# Altium project PW-TPS6213x-TestDemo.PrjPCB
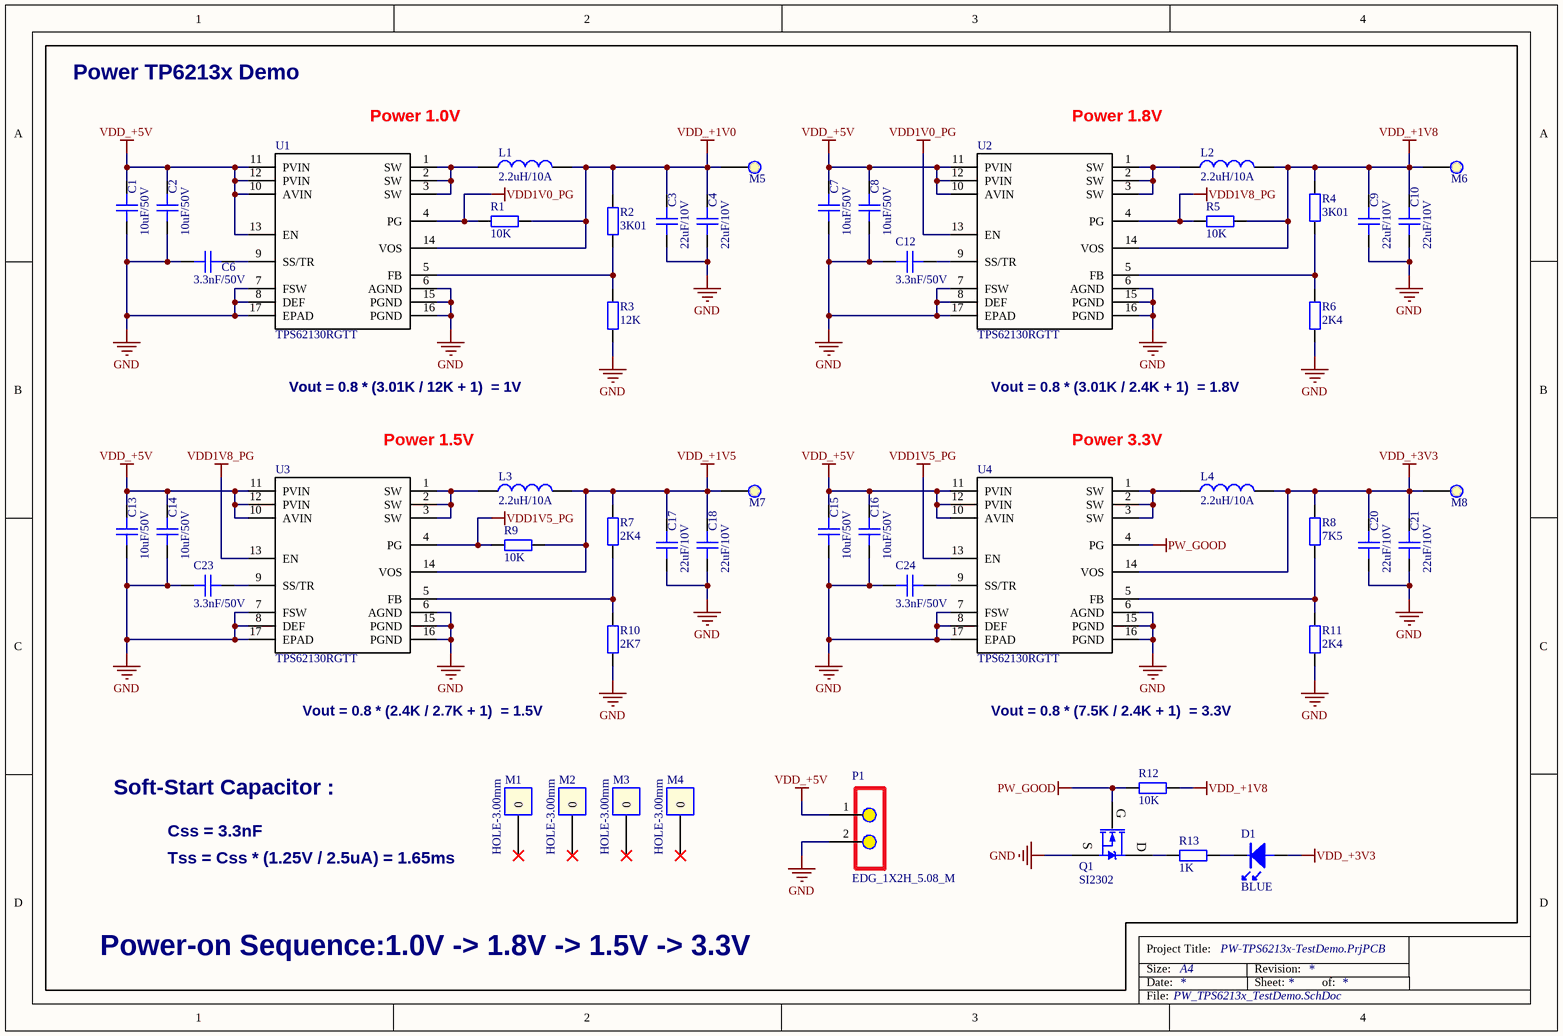
[diagram p0: PW_TPS6213x_TestDemo.SchDoc]
1 sheet, 52 parts. Net scope: global (net labels, ports and power ports of the same name join across sheets).
Board file: PW_TPS6213x_TestDemo.PcbDoc

## Sheet PW_TPS6213x_TestDemo.SchDoc
size A4

### Parts
C1  value 10uF/50V  [C1206]  (hidden comment: C_B2_10uF_50V_C1206_20%)
C2  value 10uF/50V  [C1206]  (hidden comment: C_B2_10uF_50V_C1206_20%)
C3  value 22uF/10V  [C0805]  (hidden comment: C_B2_22uF_10V_C0805_20%)
C4  value 22uF/10V  [C0805]  (hidden comment: C_B2_22uF_10V_C0805_20%)
C6  value 3.3nF/50V  [C0603]  (hidden comment: C_B2_3.3nF_50V_C0603_10%)
C7  value 10uF/50V  [C1206]  (hidden comment: C_B2_10uF_50V_C1206_20%)
C8  value 10uF/50V  [C1206]  (hidden comment: C_B2_10uF_50V_C1206_20%)
C9  value 22uF/10V  [C0805]  (hidden comment: C_B2_22uF_10V_C0805_20%)
C10  value 22uF/10V  [C0805]  (hidden comment: C_B2_22uF_10V_C0805_20%)
C12  value 3.3nF/50V  [C0603]  (hidden comment: C_B2_3.3nF_50V_C0603_10%)
C13  value 10uF/50V  [C1206]  (hidden comment: C_B2_10uF_50V_C1206_20%)
C14  value 10uF/50V  [C1206]  (hidden comment: C_B2_10uF_50V_C1206_20%)
C15  value 10uF/50V  [C1206]  (hidden comment: C_B2_10uF_50V_C1206_20%)
C16  value 10uF/50V  [C1206]  (hidden comment: C_B2_10uF_50V_C1206_20%)
C17  value 22uF/10V  [C0805]  (hidden comment: C_B2_22uF_10V_C0805_20%)
C18  value 22uF/10V  [C0805]  (hidden comment: C_B2_22uF_10V_C0805_20%)
C20  value 22uF/10V  [C0805]  (hidden comment: C_B2_22uF_10V_C0805_20%)
C21  value 22uF/10V  [C0805]  (hidden comment: C_B2_22uF_10V_C0805_20%)
C23  value 3.3nF/50V  [C0603]  (hidden comment: C_B2_3.3nF_50V_C0603_10%)
C24  value 3.3nF/50V  [C0603]  (hidden comment: C_B2_3.3nF_50V_C0603_10%)
D1  value BLUE  [LED0805]  (hidden comment: D_D2_LED-BLUE_LED0805)
L1  value 2.2uH/10A  [L_MWSA0603S]  (hidden comment: L_C2_2.2uH_10A_MWSA0603S_20%_(MWSA0603S-2R2MT))
L2  value 2.2uH/10A  [L_MWSA0603S]  (hidden comment: L_C2_2.2uH_10A_MWSA0603S_20%_(MWSA0603S-2R2MT))
L3  value 2.2uH/10A  [L_MWSA0603S]  (hidden comment: L_C2_2.2uH_10A_MWSA0603S_20%_(MWSA0603S-2R2MT))
L4  value 2.2uH/10A  [L_MWSA0603S]  (hidden comment: L_C2_2.2uH_10A_MWSA0603S_20%_(MWSA0603S-2R2MT))
M1  value HOLE-3.00mm  [M3 3.5x6mm]  (hidden comment: M_HOLE-3.00mm)
M2  value HOLE-3.00mm  [M3 3.5x6mm]  (hidden comment: M_HOLE-3.00mm)
M3  value HOLE-3.00mm  [M3 3.5x6mm]  (hidden comment: M_HOLE-3.00mm)
M4  value HOLE-3.00mm  [M3 3.5x6mm]  (hidden comment: M_HOLE-3.00mm)
M5  M_TP_HOLE  [TP-HOLE]  (value not drawn)  (no BOM)
M6  M_TP_HOLE  [TP-HOLE]  (value not drawn)  (no BOM)
M7  M_TP_HOLE  [TP-HOLE]  (value not drawn)  (no BOM)
M8  M_TP_HOLE  [TP-HOLE]  (value not drawn)  (no BOM)
P1  value EDG_1X2H_5.08_M  [KF2EDGK5.08-2P_H]  (hidden comment: P_EDG_1X2H_5.08_M)
Q1  value SI2302  [SOT23-3N]  (hidden comment: Q_B2_SI2302_SOT23-3N)
R1  value 10K  [R0603]  (hidden comment: R_B2_10K_1/10W_R0603_1%)
R2  value 3K01  [R0603]  (hidden comment: R_B2_3K01_1/10W_R0603_1%)
R3  value 12K  [R0603]  (hidden comment: R_B2_12K_1/10W_R0603_1%)
R4  value 3K01  [R0603]  (hidden comment: R_B2_3K01_1/10W_R0603_1%)
R5  value 10K  [R0603]  (hidden comment: R_B2_10K_1/10W_R0603_1%)
R6  value 2K4  [R0603]  (hidden comment: R_B2_2K4_1/10W_R0603_1%)
R7  value 2K4  [R0603]  (hidden comment: R_B2_2K4_1/10W_R0603_1%)
R8  value 7K5  [R0603]  (hidden comment: R_B2_7K5_1/10W_R0603_1%)
R9  value 10K  [R0603]  (hidden comment: R_B2_10K_1/10W_R0603_1%)
R10  value 2K7  [R0603]  (hidden comment: R_B2_2K7_1/10W_R0603_1%)
R11  value 2K4  [R0603]  (hidden comment: R_B2_2K4_1/10W_R0603_1%)
R12  value 10K  [R0603]  (hidden comment: R_B2_10K_1/10W_R0603_1%)
R13  value 1K  [R0603]  (hidden comment: R_B2_1K_1/10W_R0603_1%)
U1  value TPS62130RGTT  [QFN16-3X3-EP]  (hidden comment: U_TPS62130RGTT_QFN16)
U2  value TPS62130RGTT  [QFN16-3X3-EP]  (hidden comment: U_TPS62130RGTT_QFN16)
U3  value TPS62130RGTT  [QFN16-3X3-EP]  (hidden comment: U_TPS62130RGTT_QFN16)
U4  value TPS62130RGTT  [QFN16-3X3-EP]  (hidden comment: U_TPS62130RGTT_QFN16)

### Nets
GND: C1.1 C2.1 C3.1 C4.1 C6.1 C7.1 C8.1 C9.1 C10.1 C12.1 C13.1 C14.1 C15.1 C16.1 C17.1 C18.1 C20.1 C21.1 C23.1 C24.1 P1.2 Q1.2(S) R3.1 R6.1 R10.1 R11.1 U1.6(AGND) U1.7(FSW) U1.8(DEF) U1.15(PGND) U1.16(PGND) U1.17(EPAD) U2.6(AGND) U2.7(FSW) U2.8(DEF) U2.15(PGND) U2.16(PGND) U2.17(EPAD) U3.6(AGND) U3.7(FSW) U3.8(DEF) U3.15(PGND) U3.16(PGND) U3.17(EPAD) U4.6(AGND) U4.7(FSW) U4.8(DEF) U4.15(PGND) U4.16(PGND) U4.17(EPAD)
PW_GOOD: Q1.1(G) R12.2 U4.4(PG)
VDD1V0_PG: R1.1 U1.4(PG) U2.13(EN)
VDD1V5_PG: R9.1 U3.4(PG) U4.13(EN)
VDD1V8_PG: R5.1 U2.4(PG) U3.13(EN)
VDD_+1V0: C3.2 C4.2 L1.2 M5.1 R1.2 R2.2 U1.14(VOS)
VDD_+1V5: C17.2 C18.2 L3.2 M7.1 R7.2 R9.2 U3.14(VOS)
VDD_+1V8: C9.2 C10.2 L2.2 M6.1 R4.2 R5.2 R12.1 U2.14(VOS)
VDD_+3V3: C20.2 C21.2 D1.1(A) L4.2 M8.1 R8.2 U4.14(VOS)
VDD_+5V: C1.2 C2.2 C7.2 C8.2 C13.2 C14.2 C15.2 C16.2 P1.1 U1.10(AVIN) U1.11(PVIN) U1.12(PVIN) U1.13(EN) U2.10(AVIN) U2.11(PVIN) U2.12(PVIN) U3.10(AVIN) U3.11(PVIN) U3.12(PVIN) U4.10(AVIN) U4.11(PVIN) U4.12(PVIN)
NetC6_2: C6.2 U1.9(SS/TR)
NetC12_2: C12.2 U2.9(SS/TR)
NetC23_2: C23.2 U3.9(SS/TR)
NetC24_2: C24.2 U4.9(SS/TR)
NetD1_2: D1.2(K) R13.2
NetL1_1: L1.1 U1.1(SW) U1.2(SW) U1.3(SW)
NetL2_1: L2.1 U2.1(SW) U2.2(SW) U2.3(SW)
NetL3_1: L3.1 U3.1(SW) U3.2(SW) U3.3(SW)
NetL4_1: L4.1 U4.1(SW) U4.2(SW) U4.3(SW)
NetQ1_3: Q1.3(D) R13.1
NetR2_1: R2.1 R3.2 U1.5(FB)
NetR4_1: R4.1 R6.2 U2.5(FB)
NetR7_1: R7.1 R10.2 U3.5(FB)
NetR8_1: R8.1 R11.2 U4.5(FB)

Not connected (* = marked no-connect by the designer): M1 0*; M2 0*; M3 0*; M4 0*

### Notes on the sheet
- Power TP6213x Demo
- Power 1.0V
- Power 1.8V
- Vout = 0.8 * (3.01K / 12K + 1)  = 1V
- Power 1.5V
- Vout = 0.8 * (3.01K / 2.4K + 1)  = 1.8V
- Power 3.3V
- Vout = 0.8 * (2.4K / 2.7K + 1)  = 1.5V
- Vout = 0.8 * (7.5K / 2.4K + 1)  = 3.3V
- Soft-Start Capacitor :
- Css = 3.3nF
- Tss = Css * (1.25V / 2.5uA) = 1.65ms
- Power-on Sequence:1.0V -> 1.8V -> 1.5V -> 3.3V
- Date:
- Size:
- Project Title:
- A4
- Revision:
- Sheet:
- of:
- File:

### Library data of the parts
C1 C2 C7 C8 C13-C16 = C_B2_10uF_50V_C1206_20%: ERP: 01.02.03.005
C3 C4 C9 C10 C17 C18 C20 C21 = C_B2_22uF_10V_C0805_20%: X5R; ERP: 01.02.02.037
M1-M4 = M_HOLE-3.00mm: Note: NC
M5-M8 = M_TP_HOLE: Value: Testpoint; Note: NC
P1 = P_EDG_1X2H_5.08_M: Bend foot 5.08EDG; ERP: 01.10.199C
Q1 = Q_B2_SI2302_SOT23-3N: N-channel FET; ERP: 01.05.01.173
R1 R5 R9 R12 = R_B2_10K_1/10W_R0603_1%: ERP: 01.01.02.030
R2 R4 = R_B2_3K01_1/10W_R0603_1%: ERP: 01.01.02.083
R3 = R_B2_12K_1/10W_R0603_1%: ERP: 01.01.02.081
R6 R7 R11 = R_B2_2K4_1/10W_R0603_1%: ERP: 01.01.02.086
R8 = R_B2_7K5_1/10W_R0603_1%: ERP: 01.01.02.085
R10 = R_B2_2K7_1/10W_R0603_1%: ERP: 01.01.02.093
R13 = R_B2_1K_1/10W_R0603_1%: ERP: 01.01.02.040
U1-U4 = U_TPS62130RGTT_QFN16: TPS6213x 3-V to17-V, 3-A Step-Down Converter In 3-mm × 3-mm QFN Package; ERP: *
D1 = D_D2_LED-BLUE_LED0805: ERP: 01.09.002
L1-L4 = L_C2_2.2uH_10A_MWSA0603S_20%_(MWSA0603S-2R2MT): ERP: 01.03.050